# Altium schematic sheet 3V3_to_5V.SchDoc
size A4; CompanyName: Technische Hochschule Nürnberg Georg Simon Ohm; Address1: Fürther Straße 250; Address2: 90429 Nürnberg; Address3: GERMANY; DocumentNumber: 3; SheetNumber: 3; SheetTotal: 16; CompanyName2: Institut ELSYS
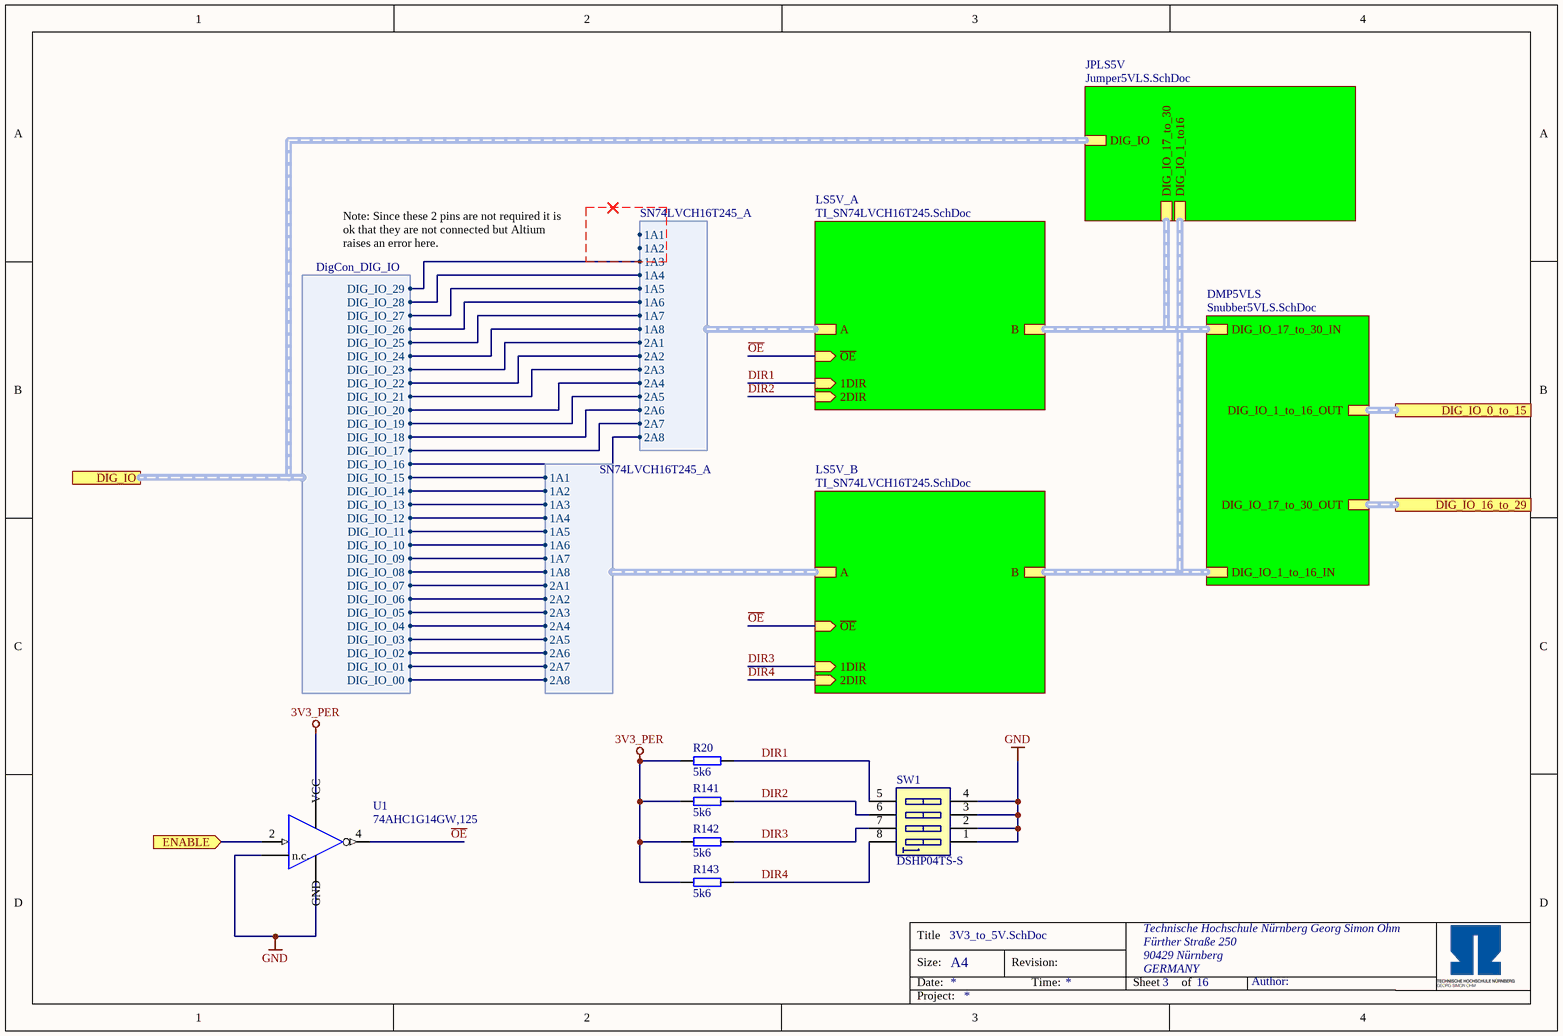
[diagram p0: 3V3_to_5V.SchDoc]

## Parts
R20  5k6  [RES 0603_1608]
R141  5k6  [RES 0603_1608]
R142  5k6  [RES 0603_1608]
R143  5k6  [RES 0603_1608]
SW1  DSHP04TS-S  [416131160804]
U1  74AHC1G14GW,125  [SOT353-1_N]

## Sub-sheets
DMP5VLS = Snubber5VLS.SchDoc: DIG_IO_1_to_16_IN (harness SN74LVCH16T245_B), DIG_IO_1_to_16_OUT (harness SN74LVCH16T245_B), DIG_IO_17_to_30_IN (harness SN74LVCH16T245_B), DIG_IO_17_to_30_OUT (harness SN74LVCH16T245_B)
JPLS5V = Jumper5VLS.SchDoc: DIG_IO (harness DigCon_DIG_IO), DIG_IO_17_to_30 (harness SN74LVCH16T245_B), DIG_IO_1_to16 (harness SN74LVCH16T245_B)
LS5V_A = TI_SN74LVCH16T245.SchDoc: A (harness SN74LVCH16T245_A), B (harness SN74LVCH16T245_B), 2DIR (in), ~{OE} (in), 1DIR (in)
LS5V_B = TI_SN74LVCH16T245.SchDoc: A (harness SN74LVCH16T245_A), B (harness SN74LVCH16T245_B), ~{OE} (in), 2DIR (in), 1DIR (in)

## Ports
DIG_IO (harness DigCon_DIG_IO), DIG_IO_0_to_15 (harness SN74LVCH16T245_B), DIG_IO_16_to_29 (harness SN74LVCH16T245_B), ENABLE (in)

## Harnesses
SN74LVCH16T245_A: 1A1, 1A2, 1A3, 1A4, 1A5, 1A6, 1A7, 1A8, 2A1, 2A2, 2A3, 2A4, 2A5, 2A6, 2A7, 2A8
DigCon_DIG_IO: DIG_IO_00, DIG_IO_01, DIG_IO_02, DIG_IO_03, DIG_IO_04, DIG_IO_05, DIG_IO_06, DIG_IO_07, DIG_IO_08, DIG_IO_09, DIG_IO_10, DIG_IO_11, DIG_IO_12, DIG_IO_13, DIG_IO_14, DIG_IO_15, DIG_IO_16, DIG_IO_17, DIG_IO_18, DIG_IO_19, DIG_IO_20, DIG_IO_21, DIG_IO_22, DIG_IO_23, DIG_IO_24, DIG_IO_25, DIG_IO_26, DIG_IO_27, DIG_IO_28, DIG_IO_29

## Nets
3V3_PER: R20.2 R141.2 R142.2 R143.2 U1.5(VCC)
GND: SW1.1 SW1.2 SW1.3 SW1.4 U1.1(n.c.) U1.3(GND)
DIR1: R20.1 SW1.5 ; sheet LS5V_A/1DIR
DIR2: R141.1 SW1.6 ; sheet LS5V_A/2DIR
DIR3: R142.1 SW1.7 ; sheet LS5V_B/1DIR
DIR4: R143.1 SW1.8 ; sheet LS5V_B/2DIR
ENABLE: U1.2(A) ; port ENABLE
~{OE}: U1.4(~{Y}) ; sheet LS5V_B/~{OE}, sheet LS5V_A/~{OE}
(unnamed): sheet LS5V_B/A.1A1, port DIG_IO.DIG_IO_15
(unnamed): sheet LS5V_B/A.1A2, port DIG_IO.DIG_IO_14
(unnamed): sheet LS5V_B/A.1A3, port DIG_IO.DIG_IO_13
(unnamed): sheet LS5V_B/A.1A4, port DIG_IO.DIG_IO_12
(unnamed): sheet LS5V_B/A.1A5, port DIG_IO.DIG_IO_11
(unnamed): sheet LS5V_B/A.1A6, port DIG_IO.DIG_IO_10
(unnamed): sheet LS5V_B/A.1A7, port DIG_IO.DIG_IO_09
(unnamed): sheet LS5V_B/A.1A8, port DIG_IO.DIG_IO_08
(unnamed): sheet LS5V_B/A.2A1, port DIG_IO.DIG_IO_07
(unnamed): sheet LS5V_B/A.2A2, port DIG_IO.DIG_IO_06
(unnamed): sheet LS5V_B/A.2A3, port DIG_IO.DIG_IO_05
(unnamed): sheet LS5V_B/A.2A4, port DIG_IO.DIG_IO_04
(unnamed): sheet LS5V_B/A.2A5, port DIG_IO.DIG_IO_03
(unnamed): sheet LS5V_B/A.2A6, port DIG_IO.DIG_IO_02
(unnamed): sheet LS5V_B/A.2A7, port DIG_IO.DIG_IO_01
(unnamed): sheet LS5V_B/A.2A8, port DIG_IO.DIG_IO_00
(unnamed): port DIG_IO.DIG_IO_16, sheet LS5V_A/A.2A8
(unnamed): port DIG_IO.DIG_IO_17, sheet LS5V_A/A.2A7
(unnamed): port DIG_IO.DIG_IO_18, sheet LS5V_A/A.2A6
(unnamed): port DIG_IO.DIG_IO_19, sheet LS5V_A/A.2A5
(unnamed): port DIG_IO.DIG_IO_20, sheet LS5V_A/A.2A4
(unnamed): port DIG_IO.DIG_IO_21, sheet LS5V_A/A.2A3
(unnamed): port DIG_IO.DIG_IO_22, sheet LS5V_A/A.2A2
(unnamed): port DIG_IO.DIG_IO_23, sheet LS5V_A/A.2A1
(unnamed): port DIG_IO.DIG_IO_24, sheet LS5V_A/A.1A8
(unnamed): port DIG_IO.DIG_IO_25, sheet LS5V_A/A.1A7
(unnamed): port DIG_IO.DIG_IO_26, sheet LS5V_A/A.1A6
(unnamed): port DIG_IO.DIG_IO_27, sheet LS5V_A/A.1A5
(unnamed): port DIG_IO.DIG_IO_28, sheet LS5V_A/A.1A4
(unnamed): port DIG_IO.DIG_IO_29, sheet LS5V_A/A.1A3

## Buses and harness runs
harness port DIG_IO = sheet JPLS5V/DIG_IO
harness port DIG_IO_0_to_15 = sheet DMP5VLS/DIG_IO_1_to_16_OUT
harness port DIG_IO_16_to_29 = sheet DMP5VLS/DIG_IO_17_to_30_OUT
harness sheet DMP5VLS/DIG_IO_1_to_16_IN = sheet JPLS5V/DIG_IO_1_to16 = sheet LS5V_B/B
harness sheet DMP5VLS/DIG_IO_17_to_30_IN = sheet JPLS5V/DIG_IO_17_to_30 = sheet LS5V_A/B

## Notes on the sheet
- Note: Since these 2 pins are not required it is ok that they are not connected but Altium raises an error here.
- Title
- Size:
- Date:
- A4
- Revision:
- Time:
- Sheet
- of
- Author:
- Project:

## Library data of the parts
R20 R141-R143 = RK73B1JTTDD562J: SMD resistor E24 series; Manufacturer: KOA Speer; Tolerance: 5%; Created from: MGremer; Manufacturer Part Number: RK73B1JTTDD562J; PartID: 92; Created On: 14.12.2020 16:17:14; ComponentLink1Description: Datasheet; ComponentLink1URL: https://www.mouser.de/datasheet/2/219/RK73B-1825463.pdf; Component Type: SMD resistor; Device Package: 0603; Last Updated: 04.03.2021 09:09:42; Mounting Type: SMD; Supplier 1: Mouser; Supplier Part Number 1: 660-RK73B1JTTDD562J; Type: Resistor; Value: 5k6; Live Cycle Status: 1; Stock number: Labor SMD Container; LCSC Part Number: C23189; Supplier 2: LCSC; Supplier Part Number 2: C23189
SW1 = DSHP04TS-S: 04p, 1.27mm Pitch, Horizontal, HP Type, SMT, flat Actuator, black, with Tape, T&R; Manufacturer: XKB Connectivity; Created from: T. Wendt; Manufacturer Part Number: DSHP04TS-S; PartID: 6; Created On: 02.03.2021 14:59:37; ComponentLink1Description: Datasheet; ComponentLink1URL: https://datasheet.lcsc.com/szlcsc/1912111437_XKB-Connectivity-DSHP04TS-S_C319050.pdf; Component Type: DIP-Switch; Device Package: DIP; Last Updated: 02.03.2021 14:59:37; Minimum Order: 1; Mounting Type: SMD; Supplier 1: LCSC; Supplier Part Number 1: C319050; Type: DIP-Switch; Live Cycle Status: 1; LCSC Part Number: C319050; Stock number: not stored
U1 = 74AHC1G14GW,125: Inverting Schmitt trigger; Manufacturer: Nexperia; Value: 5.5 V; Created from: MGremer; Manufacturer Part Number: 74AHC1G14GW,125; PartID: 1; Created On: 19.01.2021 10:03:39; ComponentLink1Description: Datasheet; ComponentLink1URL: https://www.mouser.de/datasheet/2/916/74AHC_AHCT1G14-1319577.pdf; Component Type: Inverting Schmitt trigger; Device Package: TSSOP-5; Last Updated: 04.03.2021 09:06:25; Mounting Type: SMD; Operating Temperature: -40 - 125 °C; Series: 74AHC; Supplier 1: Mouser; Supplier Part Number 1: 771-74AHC1G14GW-G; Supplier 2: LCSC; Supplier Part Number 2: C282410; Type: Schmitt trigger; Live Cycle Status: 1; Stock number: not stored; LCSC Part Number: C282410